# Altium schematic sheet PCI short card universal - 32 BIT.schdoc: PCI short card universal - 32 BIT
size A3; Organization: Organization; Address1: Address1; Address2: Address2; Address3: Address3; Address4: Address4; DocumentNumber: 1; Revision: 0; SheetNumber: 2; SheetTotal: 2; PageSetup: Record=PageOptions|CenterHorizontal=True|CenterVertical=True|PrintScale=0.70|XCorrection=1.00|YCorrection=1.00|PrintKind=1|BorderSize=5000000|LeftOffset=0|BottomOffset=0|Orientation=2|PaperLength=1000|PaperWidth=1000|Scale=100|PaperSource=15|PrintQuality=600|MediaType=1|DitherType=10|PaperKind=Letter|PrintScaleMode=1
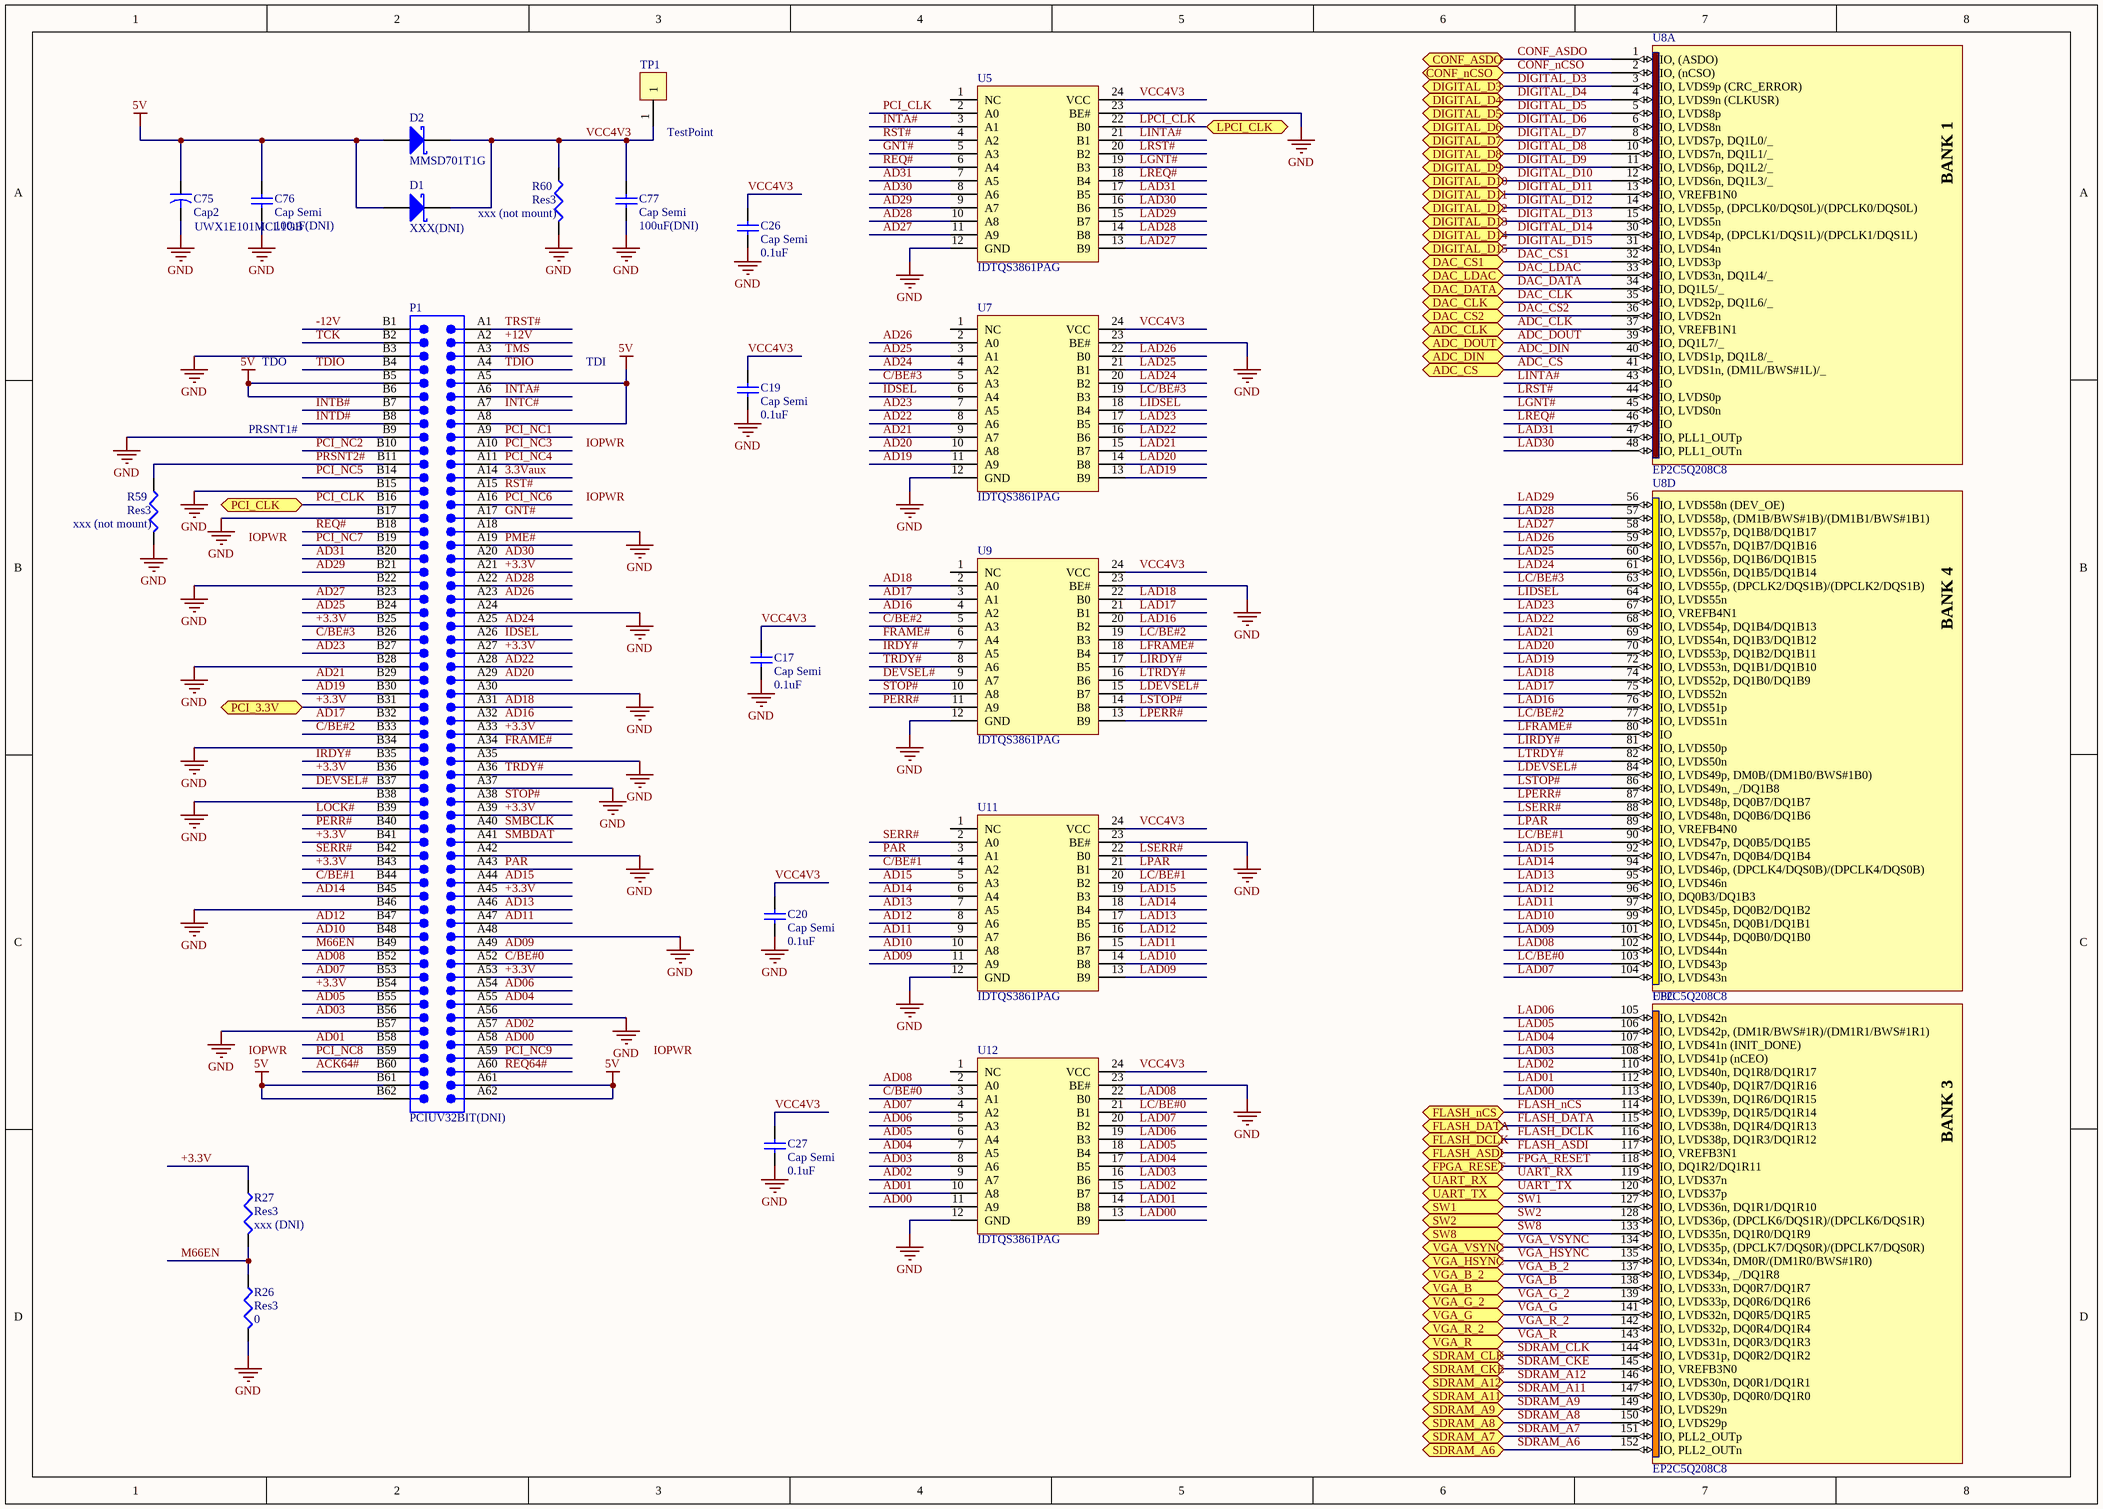
[diagram p0: PCI short card universal - 32 BIT.schdoc]

## Parts
C17  Cap Semi  value 0.1uF  [RESC1608N]
C19  Cap Semi  value 0.1uF  [RESC1608N]
C20  Cap Semi  value 0.1uF  [RESC1608N]
C26  Cap Semi  value 0.1uF  [RESC1608N]
C27  Cap Semi  value 0.1uF  [RESC1608N]
C75  Cap2  value UWX1E101MCL1GB  [ECEL_D8]
C76  Cap Semi  value 100uF(DNI)  [CD3225-1210]
C77  Cap Semi  value 100uF(DNI)  [CD3225-1210]
D1  XXX(DNI)  [LED3.2X1.6X1.1]
D2  MMSD701T1G  [SOD-123]
P1  PCIUV32BIT(DNI)  [PCIUV32BIT]
R26  Res3  value 0  [RESC1608N]
R27  Res3  value xxx (DNI)  [RESC1608N]
R59  Res3  value xxx (not mount)  [RESC1608N]
R60  Res3  value xxx (not mount)  [RESC1608N]
TP1  TestPoint  [HDR1X1]
U5  IDTQS3861PAG  [TSSOP24(QS3681)]
U7  IDTQS3861PAG  [TSSOP24(QS3681)]
U8  EP2C5Q208C8  [PQFP208_N]  (parts A,C,D of 9)
U9  IDTQS3861PAG  [TSSOP24(QS3681)]
U11  IDTQS3861PAG  [TSSOP24(QS3681)]
U12  IDTQS3861PAG  [TSSOP24(QS3681)]

## Ports
ADC_CLK, ADC_CS, ADC_DIN, ADC_DOUT, CONF_ASDO, CONF_nCSO, DAC_CLK, DAC_CS1, DAC_CS2, DAC_DATA, DAC_LDAC, DIGITAL_D3, DIGITAL_D4, DIGITAL_D5, DIGITAL_D6, DIGITAL_D7, DIGITAL_D8, DIGITAL_D9, DIGITAL_D10, DIGITAL_D11, DIGITAL_D12, DIGITAL_D13, DIGITAL_D14, DIGITAL_D15, FLASH_ASDI, FLASH_DATA, FLASH_DCLK, FLASH_nCS, FPGA_RESET, LPCI_CLK, PCI_3.3V, PCI_CLK, SDRAM_A6, SDRAM_A7, SDRAM_A8, SDRAM_A9, SDRAM_A11, SDRAM_A12, SDRAM_CKE, SDRAM_CLK, SW1, SW2, SW8, UART_RX, UART_TX, VGA_B, VGA_B_2, VGA_G, VGA_G_2, VGA_HSYNC, VGA_R, VGA_R_2, VGA_VSYNC

## Nets
5V: C75.1 C76.2 D1.1(A) D2.1(A) P1.A5 P1.A8 P1.A61 P1.A62 P1.B5 P1.B6 P1.B61 P1.B62
GND: C17.1 C19.1 C20.1 C26.1 C27.1 C75.2 C76.1 C77.1 P1.A18 P1.A24 P1.A30 P1.A35 P1.A37 P1.A42 P1.A48 P1.A56 P1.B3 P1.B9 P1.B15 P1.B17 P1.B22 P1.B28 P1.B34 P1.B38 P1.B46 P1.B57 R26.2 R59.2 R60.2 U5.12(GND) U5.23(BE#) U7.12(GND) U7.23(BE#) U9.12(GND) U9.23(BE#) U11.12(GND) U11.23(BE#) U12.12(GND) U12.23(BE#)
3.3Vaux: P1.A14
+3.3V: P1.A21 P1.A27 P1.A33 P1.A39 P1.A45 P1.A53 P1.B25 P1.B31 P1.B36 P1.B41 P1.B43 P1.B54 R27.1 ; port PCI_3.3V
+12V: P1.A2
-12V: P1.B1
ACK64#: P1.B60
AD00: P1.A58 U12.11(A9)
AD01: P1.B58 U12.10(A8)
AD02: P1.A57 U12.9(A7)
AD03: P1.B56 U12.8(A6)
AD04: P1.A55 U12.7(A5)
AD05: P1.B55 U12.6(A4)
AD06: P1.A54 U12.5(A3)
AD07: P1.B53 U12.4(A2)
AD08: P1.B52 U12.2(A0)
AD09: P1.A49 U11.11(A9)
AD10: P1.B48 U11.10(A8)
AD11: P1.A47 U11.9(A7)
AD12: P1.B47 U11.8(A6)
AD13: P1.A46 U11.7(A5)
AD14: P1.B45 U11.6(A4)
AD15: P1.A44 U11.5(A3)
AD16: P1.A32 U9.4(A2)
AD17: P1.B32 U9.3(A1)
AD18: P1.A31 U9.2(A0)
AD19: P1.B30 U7.11(A9)
AD20: P1.A29 U7.10(A8)
AD21: P1.B29 U7.9(A7)
AD22: P1.A28 U7.8(A6)
AD23: P1.B27 U7.7(A5)
AD24: P1.A25 U7.4(A2)
AD25: P1.B24 U7.3(A1)
AD26: P1.A23 U7.2(A0)
AD27: P1.B23 U5.11(A9)
AD28: P1.A22 U5.10(A8)
AD29: P1.B21 U5.9(A7)
AD30: P1.A20 U5.8(A6)
AD31: P1.B20 U5.7(A5)
ADC_CLK: U8.37(IO,_VREFB1N1) ; port ADC_CLK
ADC_CS: U8.41(IO,_LVDS1n,_(DM1L/BWS#1L)/_) ; port ADC_CS
ADC_DIN: U8.40(IO,_LVDS1p,_DQ1L8/_) ; port ADC_DIN
ADC_DOUT: U8.39(IO,_DQ1L7/_) ; port ADC_DOUT
C/BE#0: P1.A52 U12.3(A1)
C/BE#1: P1.B44 U11.4(A2)
C/BE#2: P1.B33 U9.5(A3)
C/BE#3: P1.B26 U7.5(A3)
CONF_ASDO: U8.1(IO,_(ASDO)) ; port CONF_ASDO
CONF_nCSO: U8.2(IO,_(nCSO)) ; port CONF_nCSO
DAC_CLK: U8.35(IO,_LVDS2p,_DQ1L6/_) ; port DAC_CLK
DAC_CS1: U8.32(IO,_LVDS3p) ; port DAC_CS1
DAC_CS2: U8.36(IO,_LVDS2n) ; port DAC_CS2
DAC_DATA: U8.34(IO,_DQ1L5/_) ; port DAC_DATA
DAC_LDAC: U8.33(IO,_LVDS3n,_DQ1L4/_) ; port DAC_LDAC
DEVSEL#: P1.B37 U9.9(A7)
DIGITAL_D3: U8.3(IO,_LVDS9p_(CRC_ERROR)) ; port DIGITAL_D3
DIGITAL_D4: U8.4(IO,_LVDS9n_(CLKUSR)) ; port DIGITAL_D4
DIGITAL_D5: U8.5(IO,_LVDS8p) ; port DIGITAL_D5
DIGITAL_D6: U8.6(IO,_LVDS8n) ; port DIGITAL_D6
DIGITAL_D7: U8.8(IO,_LVDS7p,_DQ1L0/_) ; port DIGITAL_D7
DIGITAL_D8: U8.10(IO,_LVDS7n,_DQ1L1/_) ; port DIGITAL_D8
DIGITAL_D9: U8.11(IO,_LVDS6p,_DQ1L2/_) ; port DIGITAL_D9
DIGITAL_D10: U8.12(IO,_LVDS6n,_DQ1L3/_) ; port DIGITAL_D10
DIGITAL_D11: U8.13(IO,_VREFB1N0) ; port DIGITAL_D11
DIGITAL_D12: U8.14(IO,_LVDS5p,_(DPCLK0/DQS0L)/(DPCLK0/DQS0L)) ; port DIGITAL_D12
DIGITAL_D13: U8.15(IO,_LVDS5n) ; port DIGITAL_D13
DIGITAL_D14: U8.30(IO,_LVDS4p,_(DPCLK1/DQS1L)/(DPCLK1/DQS1L)) ; port DIGITAL_D14
DIGITAL_D15: U8.31(IO,_LVDS4n) ; port DIGITAL_D15
FLASH_ASDI: U8.117(IO,_VREFB3N1) ; port FLASH_ASDI
FLASH_DATA: U8.115(IO,_LVDS38n,_DQ1R4/DQ1R13) ; port FLASH_DATA
FLASH_DCLK: U8.116(IO,_LVDS38p,_DQ1R3/DQ1R12) ; port FLASH_DCLK
FLASH_nCS: U8.114(IO,_LVDS39p,_DQ1R5/DQ1R14) ; port FLASH_nCS
FPGA_RESET: U8.118(IO,_DQ1R2/DQ1R11) ; port FPGA_RESET
FRAME#: P1.A34 U9.6(A4)
GNT#: P1.A17 U5.5(A3)
IDSEL: P1.A26 U7.6(A4)
INTA#: P1.A6 U5.3(A1)
INTB#: P1.B7
INTC#: P1.A7
INTD#: P1.B8
IRDY#: P1.B35 U9.7(A5)
LAD00: U8.113(IO,_LVDS39n,_DQ1R6/DQ1R15) U12.13(B9)
LAD01: U8.112(IO,_LVDS40p,_DQ1R7/DQ1R16) U12.14(B8)
LAD02: U8.110(IO,_LVDS40n,_DQ1R8/DQ1R17) U12.15(B7)
LAD03: U8.108(IO,_LVDS41p_(nCEO)) U12.16(B6)
LAD04: U8.107(IO,_LVDS41n_(INIT_DONE)) U12.17(B5)
LAD05: U8.106(IO,_LVDS42p,_(DM1R/BWS#1R)/(DM1R1/BWS#1R1)) U12.18(B4)
LAD06: U8.105(IO,_LVDS42n) U12.19(B3)
LAD07: U8.104(IO,_LVDS43n) U12.20(B2)
LAD08: U8.102(IO,_LVDS44n) U12.22(B0)
LAD09: U8.101(IO,_LVDS44p,_DQ0B0/DQ1B0) U11.13(B9)
LAD10: U8.99(IO,_LVDS45n,_DQ0B1/DQ1B1) U11.14(B8)
LAD11: U8.97(IO,_LVDS45p,_DQ0B2/DQ1B2) U11.15(B7)
LAD12: U8.96(IO,_DQ0B3/DQ1B3) U11.16(B6)
LAD13: U8.95(IO,_LVDS46n) U11.17(B5)
LAD14: U8.94(IO,_LVDS46p,_(DPCLK4/DQS0B)/(DPCLK4/DQS0B)) U11.18(B4)
LAD15: U8.92(IO,_LVDS47n,_DQ0B4/DQ1B4) U11.19(B3)
LAD16: U8.76(IO,_LVDS51p) U9.20(B2)
LAD17: U8.75(IO,_LVDS52n) U9.21(B1)
LAD18: U8.74(IO,_LVDS52p,_DQ1B0/DQ1B9) U9.22(B0)
LAD19: U7.13(B9) U8.72(IO,_LVDS53n,_DQ1B1/DQ1B10)
LAD20: U7.14(B8) U8.70(IO,_LVDS53p,_DQ1B2/DQ1B11)
LAD21: U7.15(B7) U8.69(IO,_LVDS54n,_DQ1B3/DQ1B12)
LAD22: U7.16(B6) U8.68(IO,_LVDS54p,_DQ1B4/DQ1B13)
LAD23: U7.17(B5) U8.67(IO,_VREFB4N1)
LAD24: U7.20(B2) U8.61(IO,_LVDS56n,_DQ1B5/DQ1B14)
LAD25: U7.21(B1) U8.60(IO,_LVDS56p,_DQ1B6/DQ1B15)
LAD26: U7.22(B0) U8.59(IO,_LVDS57n,_DQ1B7/DQ1B16)
LAD27: U5.13(B9) U8.58(IO,_LVDS57p,_DQ1B8/DQ1B17)
LAD28: U5.14(B8) U8.57(IO,_LVDS58p,_(DM1B/BWS#1B)/(DM1B1/BWS#1B1))
LAD29: U5.15(B7) U8.56(IO,_LVDS58n_(DEV_OE))
LAD30: U5.16(B6) U8.48(IO,_PLL1_OUTn)
LAD31: U5.17(B5) U8.47(IO,_PLL1_OUTp)
LC/BE#0: U8.103(IO,_LVDS43p) U12.21(B1)
LC/BE#1: U8.90(IO,_LVDS47p,_DQ0B5/DQ1B5) U11.20(B2)
LC/BE#2: U8.77(IO,_LVDS51n) U9.19(B3)
LC/BE#3: U7.19(B3) U8.63(IO,_LVDS55p,_(DPCLK2/DQS1B)/(DPCLK2/DQS1B))
LDEVSEL#: U8.84(IO,_LVDS49p,_DM0B/(DM1B0/BWS#1B0)) U9.15(B7)
LFRAME#: U8.80(IO) U9.18(B4)
LGNT#: U5.19(B3) U8.45(IO,_LVDS0n)
LIDSEL: U7.18(B4) U8.64(IO,_LVDS55n)
LINTA#: U5.21(B1) U8.43(IO)
LIRDY#: U8.81(IO,_LVDS50p) U9.17(B5)
LOCK#: P1.B39
LPAR: U8.89(IO,_VREFB4N0) U11.21(B1)
LPCI_CLK: U5.22(B0) ; port LPCI_CLK
LPERR#: U8.87(IO,_LVDS48p,_DQ0B7/DQ1B7) U9.13(B9)
LREQ#: U5.18(B4) U8.46(IO)
LRST#: U5.20(B2) U8.44(IO,_LVDS0p)
LSERR#: U8.88(IO,_LVDS48n,_DQ0B6/DQ1B6) U11.22(B0)
LSTOP#: U8.86(IO,_LVDS49n,__/DQ1B8) U9.14(B8)
LTRDY#: U8.82(IO,_LVDS50n) U9.16(B6)
M66EN: P1.B49 R26.1 R27.2
PAR: P1.A43 U11.3(A1)
PCI_CLK: P1.B16 U5.2(A0) ; port PCI_CLK
PCI_NC1: P1.A9
PCI_NC2: P1.B10
PCI_NC3: P1.A10
PCI_NC4: P1.A11
PCI_NC5: P1.B14
PCI_NC6: P1.A16
PCI_NC7: P1.B19
PCI_NC8: P1.B59
PCI_NC9: P1.A59
PERR#: P1.B40 U9.11(A9)
PME#: P1.A19
PRSNT2#: P1.B11 R59.1
REQ64#: P1.A60
REQ#: P1.B18 U5.6(A4)
RST#: P1.A15 U5.4(A2)
SDRAM_A6: U8.152(IO,_PLL2_OUTn) ; port SDRAM_A6
SDRAM_A7: U8.151(IO,_PLL2_OUTp) ; port SDRAM_A7
SDRAM_A8: U8.150(IO,_LVDS29p) ; port SDRAM_A8
SDRAM_A9: U8.149(IO,_LVDS29n) ; port SDRAM_A9
SDRAM_A11: U8.147(IO,_LVDS30p,_DQ0R0/DQ1R0) ; port SDRAM_A11
SDRAM_A12: U8.146(IO,_LVDS30n,_DQ0R1/DQ1R1) ; port SDRAM_A12
SDRAM_CKE: U8.145(IO,_VREFB3N0) ; port SDRAM_CKE
SDRAM_CLK: U8.144(IO,_LVDS31p,_DQ0R2/DQ1R2) ; port SDRAM_CLK
SERR#: P1.B42 U11.2(A0)
SMBCLK: P1.A40
SMBDAT: P1.A41
STOP#: P1.A38 U9.10(A8)
SW1: U8.127(IO,_LVDS36n,_DQ1R1/DQ1R10) ; port SW1
SW2: U8.128(IO,_LVDS36p,_(DPCLK6/DQS1R)/(DPCLK6/DQS1R)) ; port SW2
SW8: U8.133(IO,_LVDS35n,_DQ1R0/DQ1R9) ; port SW8
TCK: P1.B2
TDIO: P1.A4 P1.B4
TMS: P1.A3
TRDY#: P1.A36 U9.8(A6)
TRST#: P1.A1
UART_RX: U8.119(IO,_LVDS37n) ; port UART_RX
UART_TX: U8.120(IO,_LVDS37p) ; port UART_TX
VCC4V3: C17.2 C19.2 C20.2 C26.2 C27.2 C77.2 D1.2(K) D2.2(K) R60.1 TP1.1 U5.24(VCC) U7.24(VCC) U9.24(VCC) U11.24(VCC) U12.24(VCC)
VGA_B: U8.138(IO,_LVDS33n,_DQ0R7/DQ1R7) ; port VGA_B
VGA_B_2: U8.137(IO,_LVDS34p,__/DQ1R8) ; port VGA_B_2
VGA_G: U8.141(IO,_LVDS32n,_DQ0R5/DQ1R5) ; port VGA_G
VGA_G_2: U8.139(IO,_LVDS33p,_DQ0R6/DQ1R6) ; port VGA_G_2
VGA_HSYNC: U8.135(IO,_LVDS34n,_DM0R/(DM1R0/BWS#1R0)) ; port VGA_HSYNC
VGA_R: U8.143(IO,_LVDS31n,_DQ0R3/DQ1R3) ; port VGA_R
VGA_R_2: U8.142(IO,_LVDS32p,_DQ0R4/DQ1R4) ; port VGA_R_2
VGA_VSYNC: U8.134(IO,_LVDS35p,_(DPCLK7/DQS0R)/(DPCLK7/DQS0R)) ; port VGA_VSYNC

Not connected (* = marked no-connect by the designer): U5 1(NC); U7 1(NC); U9 1(NC); U11 1(NC); U12 1(NC)

## Notes on the sheet
- TDO
- TDI
- PRSNT1#
- Labels drawn without touching a wire or pin: IOPWR
- (in symbol EP2C5Q208C8, part A) BANK 1
- (in symbol EP2C5Q208C8, part C) BANK 3
- (in symbol EP2C5Q208C8, part D) BANK 4

## Library data of the parts
C17 C19 C20 C26 C27 = Cap Semi: Capacitor (Semiconductor SIM Model); Published: 8-Jun-2000; LatestRevisionDate: 17-Jul-2002; LatestRevisionNote: Re-released for DXP Platform.; PackageReference: C1206; Publisher: Altium Limited
C75 = Cap2: NICHICON; Published: 23-Sep-2002; PackageReference: CAPR5-4X5; Publisher: Altium Limited
D1 = D Schottky: Schottky Diode; Published: 8-Jun-2000; LatestRevisionDate: 17-Jul-2002; LatestRevisionNote: Re-released for DXP Platform.; PackageReference: SMB; Publisher: Altium Limited; Code_JEDEC: DO-214-AA
D2 = D Schottky: ON SEMI; Published: 8-Jun-2000; LatestRevisionDate: 17-Jul-2002; LatestRevisionNote: Re-released for DXP Platform.; PackageReference: SMB; Publisher: Altium Limited; Code_JEDEC: DO-214-AA
P1 = PCIUV32BIT: Card, 116-Position; Text Field6: Pins A12, A13, B12, B13, A50, A51, B50 & B51 are not present.  Alternate Layout Available; Text Field7: Published 14-Feb-2002
R26 R27 R59 R60 = Res3: Resistor; Published: 8-Jun-2000; LatestRevisionDate: 04-Mar-2005; LatestRevisionNote: PCB Footprint replaced.; PackageReference: J1-0603; Publisher: Altium Limited
U5 U7 U9 U11 U12 = QS3861: IDT
U8 = EP2C5Q208C8: ALTERA Cyclone II Family, 1.2V FPGA, 142 I/O Pins, 2 PLLs, 208-Pin PQFP, Speed Grade 8, Commercial Grade; Note: DQS signal pins named according to DQ bus modes.  "/" separates each mode. ie. Modes x8/x9 / Modes x16/x18.; Published: 4-Mar-2005; LatestRevisionDate: 13-Apr-2006; LatestRevisionNote: IPC-7351 Footprint Added.; DatasheetVersion: ver2.3, Mar-2006; PackageVersion: ver14.2, Oct-2005; PackageReference: PQFP208; Publisher: Altium Limited; PackageDescription: 208-Pin Plastic Quad Flat Pack (PQFP208); Code_JEDEC: MS-029-FA-1; ComponentLink1Description: Manufacturer Link; ComponentLink1URL: http://www.altera.com/products/devices/cyclone2/cy2-index.jsp; ComponentLink2Description: Handbook; ComponentLink2URL: http://www.altera.com/literature/hb/cyc2/cyc2_cii5v1.pdf; ComponentLink3Description: Packaging Specification; ComponentLink3URL: http://www.altera.com/literature/ds/dspkg.pdf
C76 C77 = Cap Semi: Published: 8-Jun-2000; LatestRevisionDate: 17-Jul-2002; LatestRevisionNote: Re-released for DXP Platform.; PackageReference: C1206; Publisher: Altium Limited